# Altium schematic sheet 08 SPDIF.SchDoc
size 513 x 386 mm
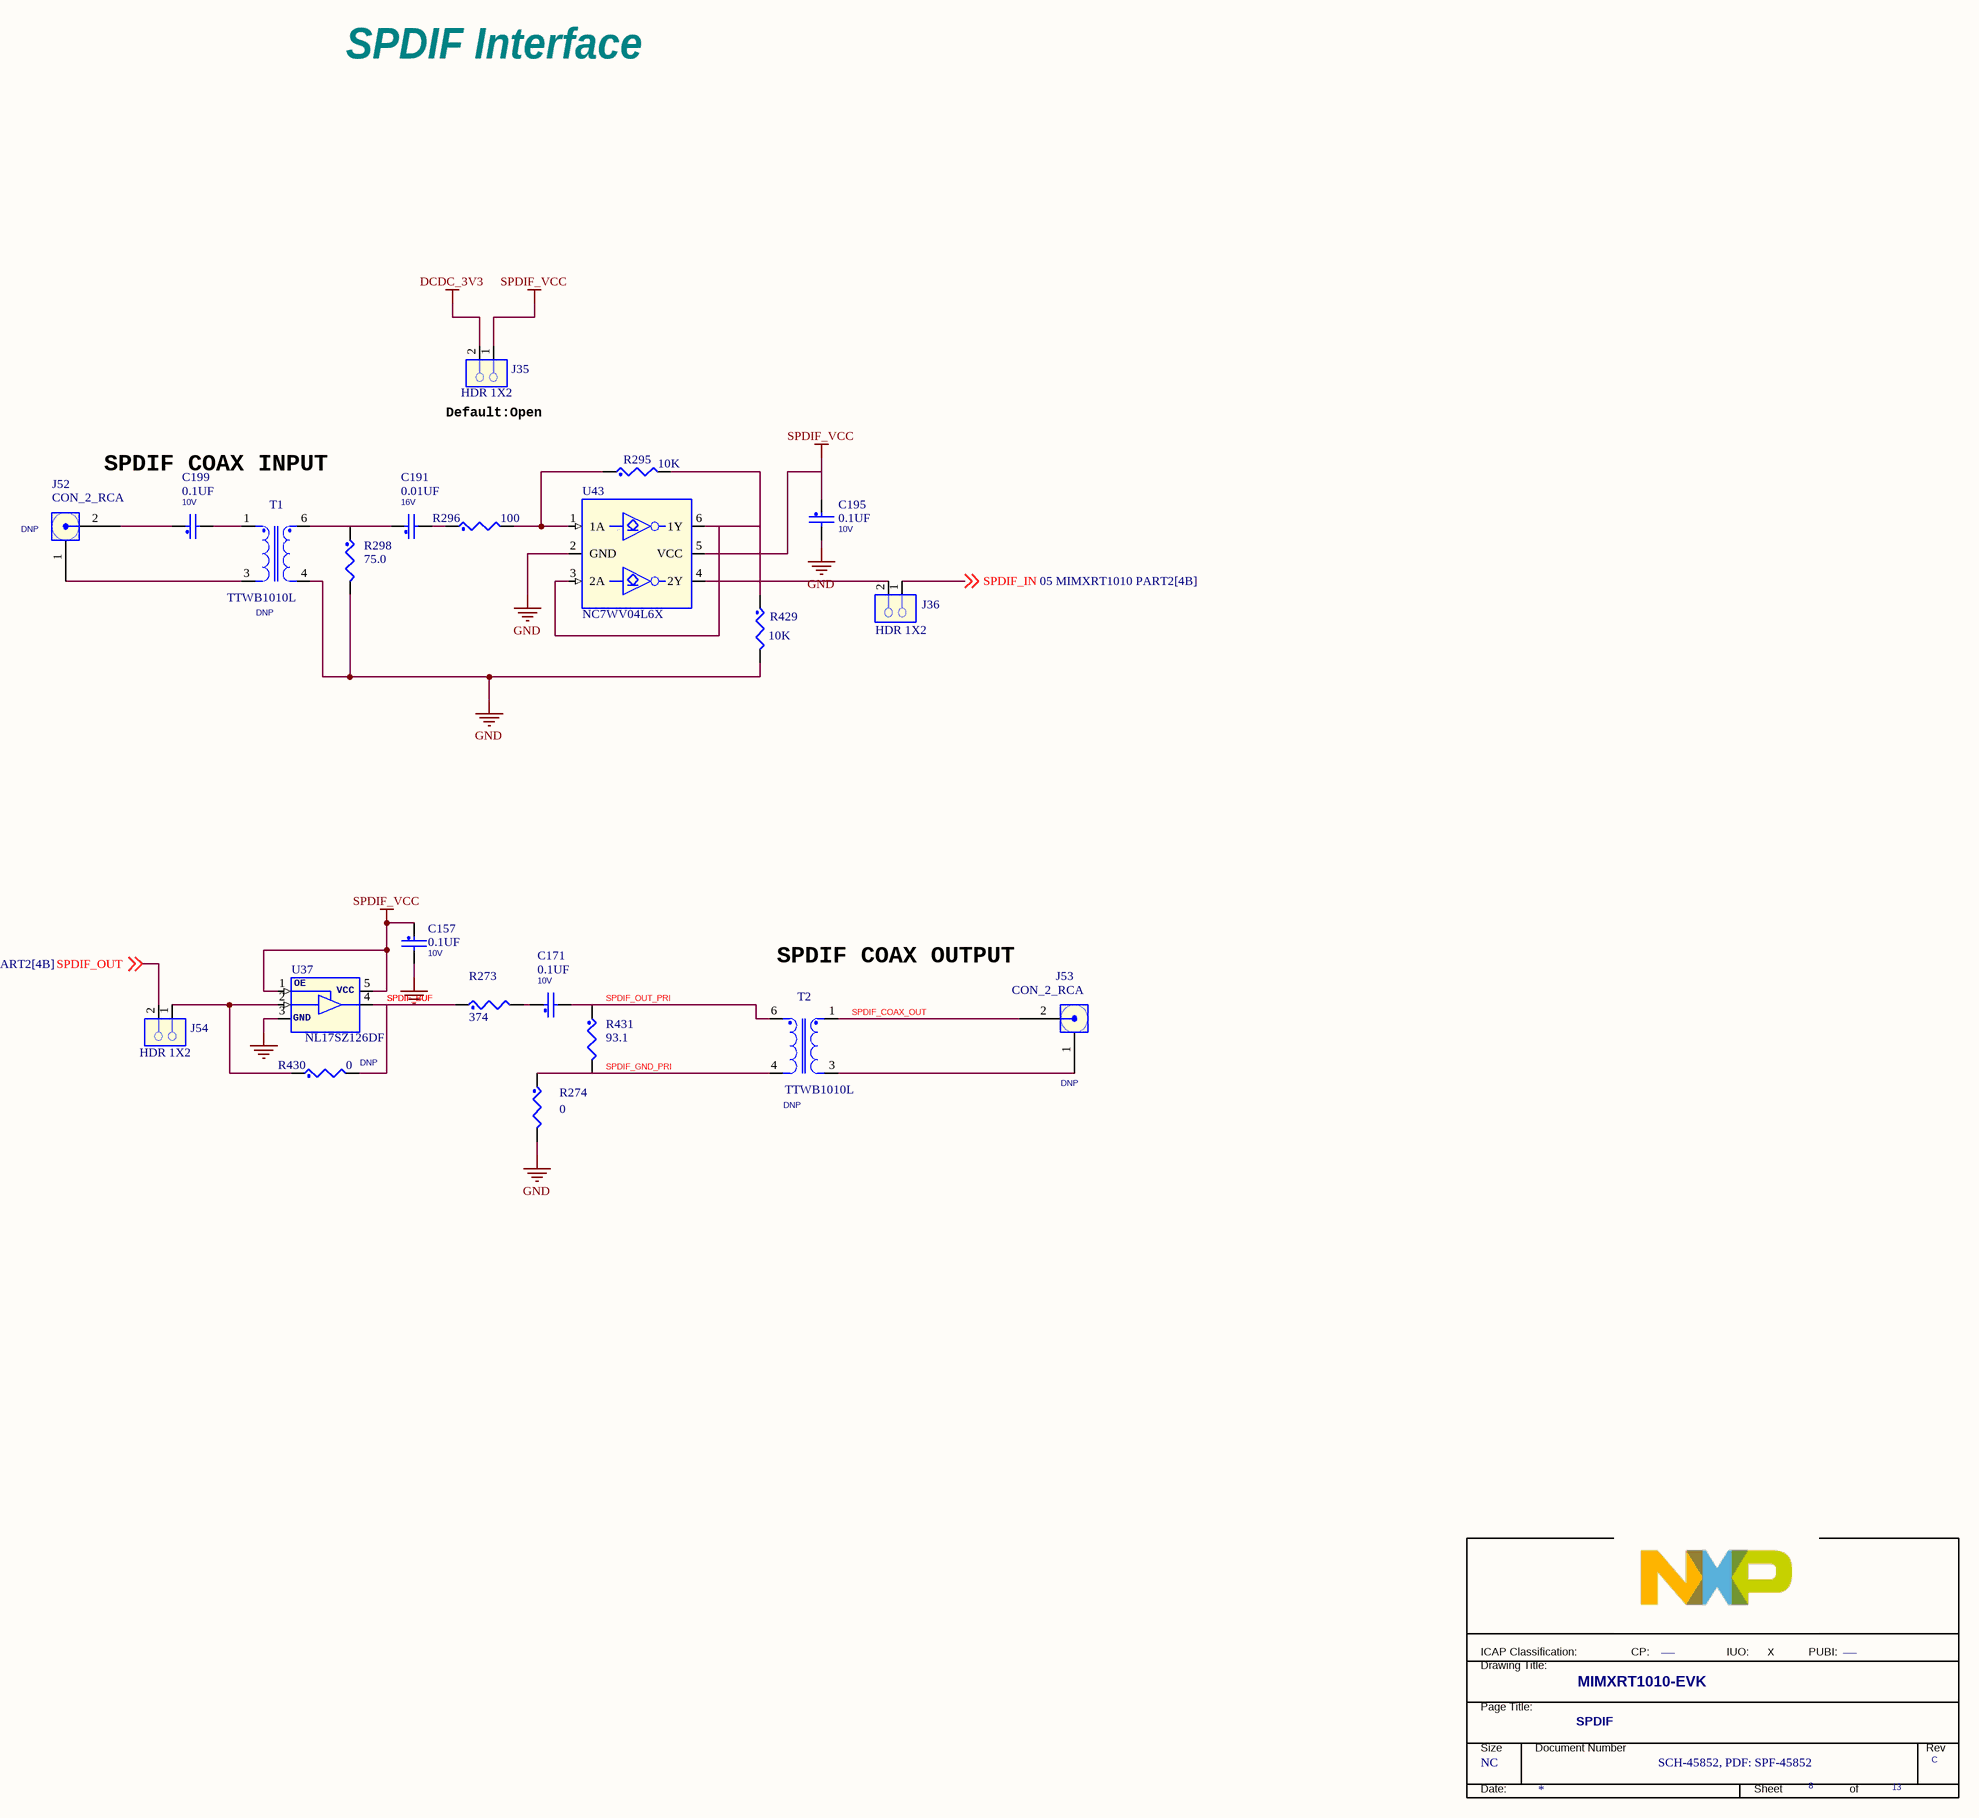
[diagram p0: 08 SPDIF.SchDoc]

## Parts
*  PUBI: ___  Doc: SCH-45852, PDF: SPF-45852  RevCode: C  Title: MIMXRT1010-EVK  Page Size: NC  Page Number: 8  Page Count: 13  PageTitle: SPDIF  (hidden comment: TitleBlock_FS)  (graphical)
C157  0.1UF  VOLTAGE: 10V  [0402_CC]
C171  0.1UF  VOLTAGE: 10V  [0402_CC]
C191  0.01UF  VOLTAGE: 16V  [0402_CC]
C195  0.1UF  VOLTAGE: 10V  [0402_CC]
C199  0.1UF  VOLTAGE: 10V  [0402_CC]
J35  HDR 1X2  [HDR102]
J36  HDR 1X2  [HDR102]
J52  CON_2_RCA  ASSY_OPT: DNP  [con2_rca_ra_th]
J53  CON_2_RCA  ASSY_OPT: DNP  [con2_rca_ra_th]
J54  HDR 1X2  [HDR102]
R273  374  [RC0805_OV]
R274  0  [0402_CC]
R295  10K  [0402_CC]
R296  100  [0402_CC]
R298  75.0  [RC0805_OV]
R429  10K  [0402_CC]
R430  0  ASSY_OPT: DNP  [0402_CC]
R431  93.1  [RC0603_OV]
T1  TTWB1010L  ASSY_OPT: DNP  [xfmr6_6p6x6p2]
T2  TTWB1010L  ASSY_OPT: DNP  [xfmr6_6p6x6p2]
U37  NL17SZ126DF  [SC-70]
U43  NC7WV04L6X  [SOT363]

## Nets
DCDC_3V3: J35.2
GND: C157.2 C195.2 R274.2 R298.2 R429.2 T1.4 U37.3(GND) U43.2(GND)
SPDIF_VCC: C157.1 C195.1 J35.1 U37.1(OE) U37.5(VCC) U43.5(VCC)
SPDIF_BUF: R273.1 R430.2 U37.4(Y)
SPDIF_COAX_OUT: J53.2 T2.1
SPDIF_GND_PRI: R274.1 R431.2 T2.4
SPDIF_IN: J36.1 ; off-sheet SPDIF_IN
SPDIF_OUT: J54.2 ; off-sheet SPDIF_OUT
SPDIF_OUT_PRI: C171.2 R431.1 T2.6
NetC171_1: C171.1 R273.2
NetC191_1: C191.1 R298.1 T1.6
NetC191_2: C191.2 R296.1
NetC199_1: C199.1 J52.2
NetC199_2: C199.2 T1.1
NetJ36_2: J36.2 U43.4(2Y)
NetJ52_1: J52.1 T1.3
NetJ53_1: J53.1 T2.3
NetJ54_1: J54.1 R430.1 U37.2(A)
NetR295_1: R295.1 R296.2 U43.1(1A)
NetR295_2: R295.2 R429.1 U43.3(2A) U43.6(1Y)

## Notes on the sheet
- SPDIF Interface
- SPDIF COAX INPUT
- (near J35) Default:Open
- (near T2) SPDIF COAX OUTPUT
- X
- (in symbol TitleBlock_FS) ICAP Classification:; CP:; IUO:; PUBI:; Drawing Title:; Page Title:; Size; Document Number; Rev; Date:; Sheet; of

## Library data of the parts
* = TitleBlock_FS: FIUO: _X_; OrgAddr2: Austin, TX 78735-8598; OrgAddr1: 6501 William Cannon Drive West; OrgName: Freescale Semiconductor; FCP: ___; Page Create Date: March  8, 1995; Page Modify Date: *
C157 C171 = CAP_NP: CAP CER 0.1UF 10V 10% X5R 0402; CLASS: DISCRETE; AGILE_PN: 150-75634; MFG_NAME01: YAGEO AMERICA; MFG_PN01: CC0402KRX5R6BB104; CAD_APPROVED: Yes; FPLIST: CC0402_25,CC0402_HD,0402_CC; Tolerance: 10%; ROHS: Yes; HEIGHT: 0.64MM; PCB Footprint: 0402_CC
C191 = CAP_NP: CAP CER 0.01UF 16V 20% X7R 0402; CLASS: DISCRETE; AGILE_PN: 150-30082; MFG_NAME01: AVX; MFG_PN01: 0402YC103MAT2A; CAD_APPROVED: Yes; FPLIST: CC0402_25,CC0402_HD,0402_CC; Tolerance: 20%; ROHS: Yes; HEIGHT: 0.56MM; TOL: 20%; PCB Footprint: 0402_CC
C195 C199 = CAP_NP: CAP CER 0.1UF 10V 10% X5R 0402; CLASS: DISCRETE; FPLIST: CC0402_25,CC0402_HD,0402_CC; CAD_APPROVED: Yes; MFG_PN01: CC0402KRX5R6BB104; MFG_NAME01: YAGEO AMERICA; AGILE_PN: 150-75634; HEIGHT: 0.64MM; ROHS: Yes; Tolerance: 10%; PCB Footprint: 0402_CC
J35 J54 = CONN_HDR_2X1: HDR 1X2 TH 100MIL SP 339H AU 98L; CLASS: IO; AGILE_PN: 210-81490; MFG_NAME01: ANYTRONIC CORPORATION LIMITED; MFG_PN01: 0901S0202011N9T-31RF; Temp_Range: -55¡ãC to +105¡ãC; CAD_APPROVED: Yes; PCB Footprint: HDR102; ROHS: Yes; HEIGHT: 8.59MM
J36 = CONN_HDR_2X1: HDR 1X2 TH 100MIL SP 339H AU 98L; CLASS: IO; CAD_APPROVED: Yes; Temp_Range: -55¡ãC to +105¡ãC; MFG_PN01: 0901S0202011N9T-31RF; MFG_NAME01: ANYTRONIC CORPORATION LIMITED; AGILE_PN: 210-81490; PCB Footprint: HDR102; HEIGHT: 8.59MM; ROHS: Yes
J52 J53 = KLPX0848A: CON 2 RCA SKT RA TH BLACK -- 512H SN; AGILE_PN: 210-78092; MFG_NAME01: KYCON; MFG_PN01: KLPX-0848A-2-B; CAD_APPROVED: Yes; PRIORITY_PN: 009-00703; PCB Footprint: con2_rca_ra_th; ROHS: Yes; HEIGHT: 13MM
R273 = RES_Dup1: RES MF 374 OHM 1/8W 1% 0805; CLASS: DISCRETE; AGILE_PN: 470-80029; MFG_NAME01: VISHAY INTERTECHNOLOGY; MFG_PN01: CRCW0805374RFKEA; CAD_APPROVED: Yes; FPLIST: RC0805_OV,RC0805,0805_CC; Tolerance: 1%; ROHS: Yes; HEIGHT: 0.5MM; TOL: 1%; PCB Footprint: RC0805_OV
R274 R430 = RES_Dup1: RES MF ZERO OHM 1/16W 5% 0402; CLASS: DISCRETE; FPLIST: RC0402_25,RC0402_HD,RC0402_X2,0402_CC; CAD_APPROVED: Yes; MFG_PN01: MCR01MZPJ000; MFG_NAME01: ROHM; AGILE_PN: 470-75394; ROHS: Yes; Tolerance: 5%; HEIGHT: 0.45 MM; PCB Footprint: 0402_CC
R295 R429 = RES_Dup1: RES MF 10K 1/16W 5% 0402; CLASS: DISCRETE; FPLIST: RC0402_25,RC0402_HD,0402_CC; CAD_APPROVED: Yes; MFG_PN01: CRCW040210K0JNED; MFG_NAME01: VISHAY INTERTECHNOLOGY; AGILE_PN: 470-75557; PCB Footprint: 0402_CC; ROHS: Yes; Tolerance: 5%; TOL: 5%; HEIGHT: 0.4 MM
R296 = RES_Dup1: RES MF 100 OHM 1/16W 1% 0402; CLASS: DISCRETE; FPLIST: RC0402_25,RC0402_HD,0402_CC; CAD_APPROVED: Yes; MFG_PN01: CR-02FL6--100R; MFG_NAME01: THYE MING TECH CO LTD; AGILE_PN: 470-30454; PCB Footprint: 0402_CC; ROHS: Yes; Tolerance: 1%; HEIGHT: 0.4 MM
R298 = RES_Dup1: RES TF 75.0 OHM 1/8W 1% 0805; CLASS: DISCRETE; AGILE_PN: 470-76238; MFG_NAME01: YAGEO AMERICA; MFG_PN01: RC0805FR-0775RL; CAD_APPROVED: Yes; FPLIST: RC0805_OV,RC0805,0805_CC; PCB Footprint: RC0805_OV; TOL: 1%; Tolerance: 1%; ROHS: Yes; HEIGHT: 0.6 MM
R431 = RES_Dup1: RES MF 93.1 OHM 1/8W 1% AEC-Q200 0603; CLASS: DISCRETE; FPLIST: RC0603_OV,RC0603,0603_CC; CAD_APPROVED: Yes; MFG_PN01: RK73H1JTTD93R1F; MFG_NAME01: KOA SPEER; AGILE_PN: 470-77900; Temp_Range: -55C to +155C; ROHS: Yes; Tolerance: 1%; HEIGHT: 0.55MM; TOL: 1%; PCB Footprint: RC0603_OV
T1 = XFMR: XFMR SMT 780UH/780UH/250MA WIDEBAND XFMR6_6.6X6.2; PART_TYPE: TRANSFORMERS; ROOM: SPDIF; AGILE_PN: 560-75273; MFG_NAME01: COILCRAFT; MFG_PN01: TTWB1010LD; CAD_APPROVED: Yes; PRIORITY_PN: 051-TTWB1010LD; PCB Footprint: xfmr6_6p6x6p2; ROHS: Yes; HEIGHT: 4.82MM
T2 = XFMR: XFMR SMT 780UH/780UH/250MA WIDEBAND XFMR6_6.6X6.2; PART_TYPE: TRANSFORMERS; PRIORITY_PN: 051-TTWB1010LD; CAD_APPROVED: Yes; MFG_PN01: TTWB1010LD; MFG_NAME01: COILCRAFT; AGILE_PN: 560-75273; ROOM: SPDIF; PCB Footprint: xfmr6_6p6x6p2; HEIGHT: 4.82MM; ROHS: Yes
U37 = 100201_SO-1: IC BUF TS 1.65-5.5V SOT-353; PRIORITY_PN: 051-NL17SZ126DF; CAD_APPROVED: YES; MFG_PN01: NL17SZ126DFT2G; MFG_NAME01: ON SEMICONDUCTOR; AGILE_PN: 312-30127; HEIGHT: 1.1 MM; ROHS: Yes; PCB Footprint: SC-70
U43 = 74AUP2G06GW: IC INVERTER ULP-A DUAL 0.93.6V MICROPAK6; PCB Footprint: MICROPAK_6P; AGILE_PN: 315-81072; MFG_NAME01: FAIRCHILD; CAD_APPROVED: Yes; CLASS: IC; MFG_PN01: NC7WV04L6X; ROHS: Yes; HEIGHT: 0.55MM